# Altium project TP2.PrjPcb
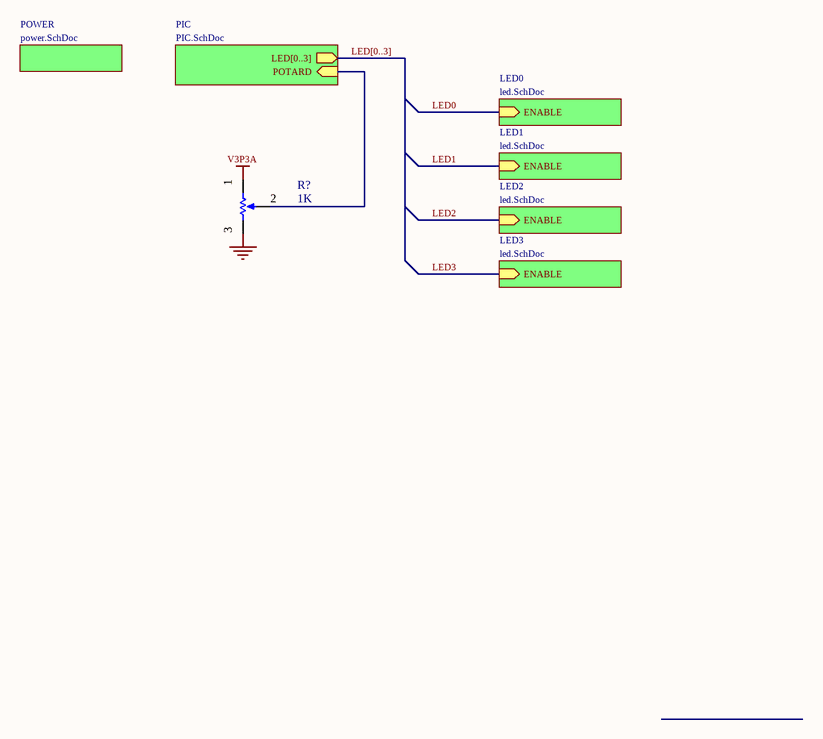
[diagram p0: SChema2.SchDoc]
4 sheets, 36 parts. Net scope: hierarchical (ports join the sheet entries above them; power ports are global).
Sheets:
  SChema2.SchDoc
    POWER = Power.SchDoc
    PIC = PIC.SchDoc
    LED0 = Led.SchDoc
    LED1 = Led.SchDoc
    LED2 = Led.SchDoc
    LED3 = Led.SchDoc

## Sheet SChema2.SchDoc
size A

### Parts
(Parts that share a designator on the sheet are numbered #1, #2 ... from top to bottom, then left to right.)
R?#1  1K  [VR5]

### Sub-sheets
LED0 = led.SchDoc: ENABLE (in)
LED1 = led.SchDoc: ENABLE (in)
LED2 = led.SchDoc: ENABLE (in)
LED3 = led.SchDoc: ENABLE (in)
PIC = PIC.SchDoc: LED[0..3] (out), POTARD (in)
POWER = power.SchDoc: no entries

### Nets
GND: R?#1.1(TOP)
V3P3A: R?#1.2(BOT)
2: R?#1.3(TAP) ; sheet PIC/POTARD

### Buses and harness runs
bus LED[0..3] = sheet PIC/LED[0..3]

### Notes on the sheet
- Labels drawn without touching a wire or pin: 1, 3

### Library data of the parts
R?#1 = RPot: Potentiometer; Sim Note: Enter the Resistance value and the set point into parameter fields.; Set Position: 0.5; Published: 8-Jun-2000; LatestRevisionDate: 17-Jul-2002; LatestRevisionNote: Re-released for DXP Platform.; PackageReference: VR5; Publisher: Altium Limited; PackageDescription: Variable Resistor, Thru-Hole; 3 Leads; Value: 1K

## Sheet Power.SchDoc
size A
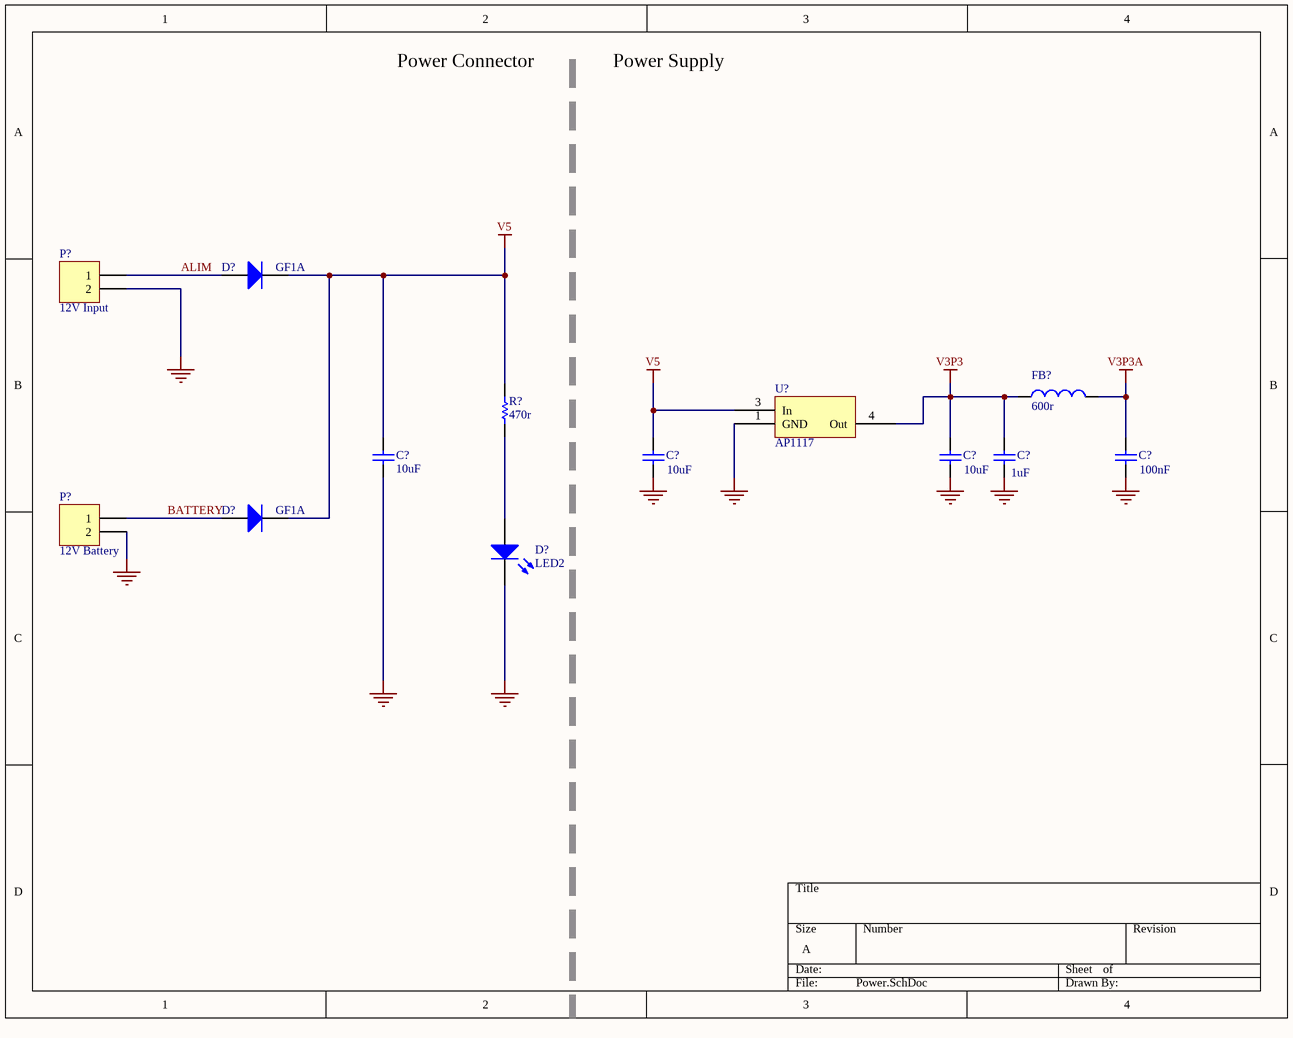
[diagram p1: Power.SchDoc]

### Parts
(Parts that share a designator on the sheet are numbered #1, #2 ... from top to bottom, then left to right.)
C?#1  value 100nF  [RAD-0.3]  (hidden comment: Cap)
C?#2  10uF  [RAD-0.3]
C?#3  value 10uF  [RAD-0.3]  (hidden comment: Cap)
C?#4  value 10uF  [RAD-0.3]  (hidden comment: Cap)
C?#5  value 1uF  [RAD-0.3]  (hidden comment: Cap)
D?#1  GF1A  [SMC]
D?#2  GF1A  [SMC]
D?#3  LED2  [3.2X1.6X1.1]
FB?  600r  [0402-A]
P?#1  12V Input  [HDR1X2]
P?#2  12V Battery  [HDR1X2]
R?#2  470r  [AXIAL-0.3]
U?#1  AP1117

### Nets
GND: C?#1.2 C?#2.1 C?#3.1 C?#4.1 C?#5.1 D?#3.2(K) P?#1.2 P?#2.2 U?#1.1(GND)
V3P3: C?#4.2 C?#5.2 FB?.1 U?#1.4(Out)
V3P3A: C?#1.1 FB?.2
V5: C?#2.2 C?#3.2 D?#1.2(K) D?#2.2(K) R?#2.2 U?#1.3(In)
ALIM: D?#1.1(A) P?#1.1
BATTERY: D?#2.1(A) P?#2.1
NetD?#3_1: D?#3.1(A) R?#2.1

### Notes on the sheet
- Power Connector
- Power Supply

### Library data of the parts
C?#1 C?#3-C?#5 = Cap: Capacitor; Published: 8-Jun-2000; LatestRevisionDate: 17-Jul-2002; LatestRevisionNote: Re-released for DXP Platform.; PackageReference: RAD-0.3; Publisher: Altium Limited; PackageDescription: Radial Cap, Thru-Hole; 2 Leads; 0.3 in Pin Spacing
C?#2 = Cap: Capacitor; Value: 100pF; Published: 8-Jun-2000; LatestRevisionDate: 17-Jul-2002; LatestRevisionNote: Re-released for DXP Platform.; PackageReference: RAD-0.3; Publisher: Altium Limited; PackageDescription: Radial Cap, Thru-Hole; 2 Leads; 0.3 in Pin Spacing
D?#1 = Diode: Default Diode; Published: 8-Jun-2000; LatestRevisionDate: 17-Jul-2002; LatestRevisionNote: Re-released for DXP Platform.; PackageVersion: Sep-1996; PackageReference: SMC; Publisher: Altium Limited; PackageDescription: DO-214-AB/SMC; 2 C-Bend Leads; Body 7.9 x 5.9 mm, inc. leads (LxW); Code_JEDEC: DO-214-AB
D?#2 = Diode: Published: 8-Jun-2000; LatestRevisionDate: 17-Jul-2002; LatestRevisionNote: Re-released for DXP Platform.; PackageVersion: Sep-1996; PackageReference: SMC; Publisher: Altium Limited; PackageDescription: DO-214-AB/SMC; 2 C-Bend Leads; Body 7.9 x 5.9 mm, inc. leads (LxW); Code_JEDEC: DO-214-AB
D?#3 = LED2: Typical RED, GREEN, YELLOW, AMBER GaAs LED; Published: 8-Jun-2000; LatestRevisionDate: 17-Jul-2002; LatestRevisionNote: Re-released for DXP Platform.; PackageVersion: Feb-2002; PackageReference: 3.2X1.6X1.1; Publisher: Altium Limited; PackageDescription: SM LED; 2 Flat Leads
FB? = Inductor: Code_IEC: 1005; Published: 8-Jun-2000; LatestRevisionDate: 29-May-2009; LatestRevisionNote: IPC-7351 Footprint Added.; PackageReference: 0402-A; Publisher: Altium Limited; PackageDescription: Chip Inductor; Code_JEITA: 0402
P?#1 P?#2 = Header 2: Header, 2-Pin; LatestRevisionDate: 17-Jul-2002; LatestRevisionNote: Re-released for DXP Platform.; Publisher: Altium Limited
R?#2 = Res1: Resistor; Value: 1K; Published: 8-Jun-2000; LatestRevisionDate: 17-Jul-2002; LatestRevisionNote: Re-released for DXP Platform.; PackageReference: AXIAL-0.3; Publisher: Altium Limited; PackageDescription: Axial Device, Thru-Hole; 2 Leads; 0.3 in Pin Spacing

## Sheet PIC.SchDoc
size B
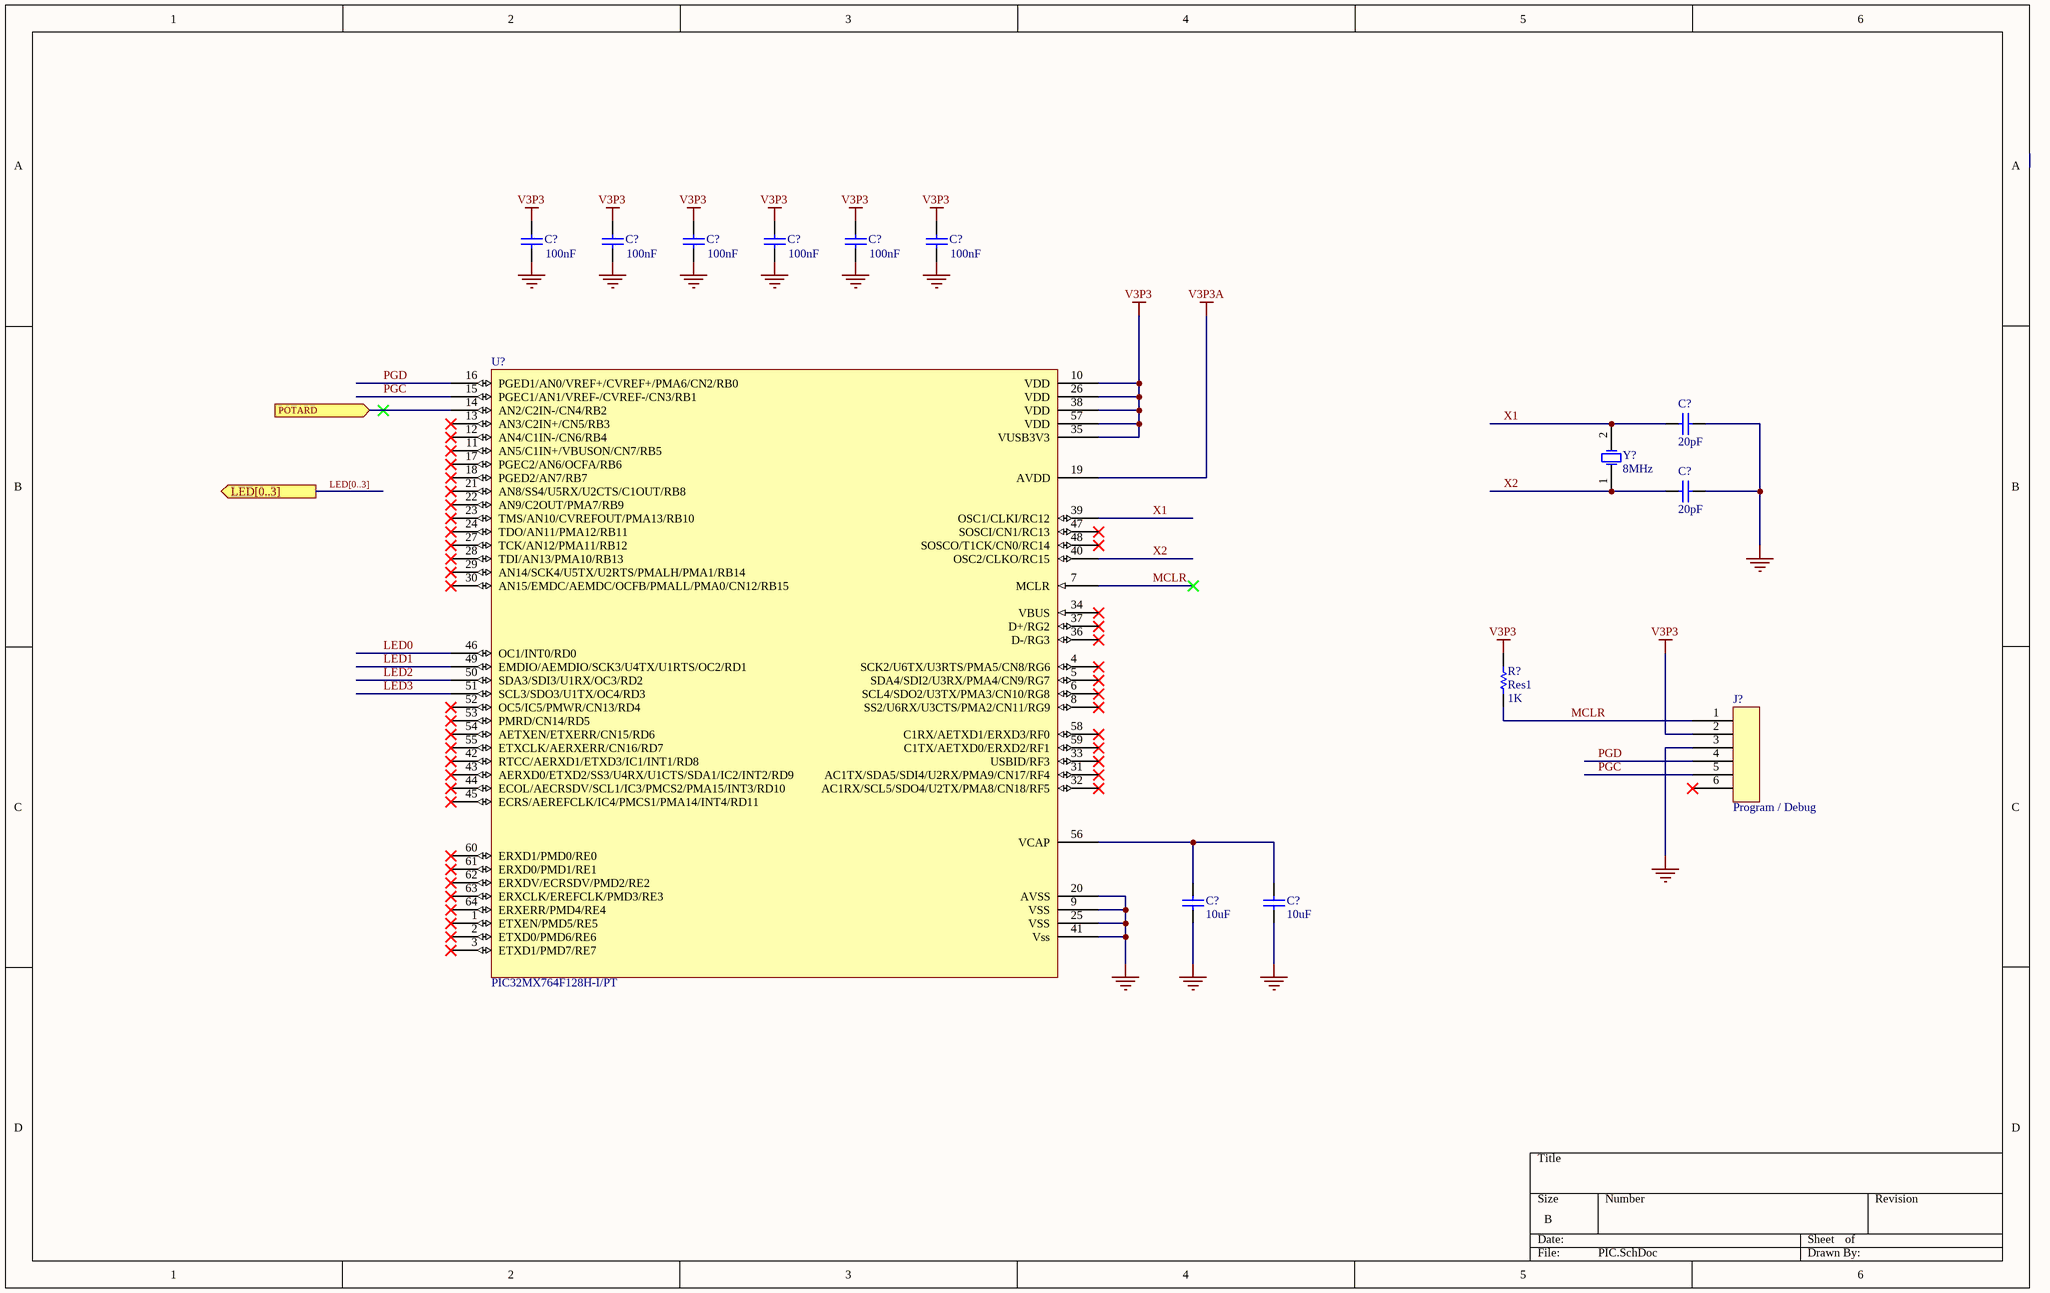
[diagram p2: PIC.SchDoc]

### Parts
(Parts that share a designator on the sheet are numbered #1, #2 ... from top to bottom, then left to right.)
C?#6  100nF  [RAD-0.3]
C?#7  100nF  [RAD-0.3]
C?#8  100nF  [RAD-0.3]
C?#9  100nF  [RAD-0.3]
C?#10  100nF  [RAD-0.3]
C?#11  100nF  [RAD-0.3]
C?#12  20pF  [RAD-0.3]
C?#13  20pF  [RAD-0.3]
C?#14  10uF  [RAD-0.3]
C?#15  10uF  [RAD-0.3]
J?  Program / Debug
R?#3  Res1  value 1K  [AXIAL-0.3]
U?#2  PIC32MX764F128H-I/PT
Y?  8MHz  [R38]

### Ports
LED[0..3] (out), POTARD (in)

### Nets
GND: C?#6.2 C?#7.2 C?#8.2 C?#9.2 C?#10.2 C?#11.2 C?#12.1 C?#13.1 C?#14.1 C?#15.1 J?.3 U?#2.9(VSS) U?#2.20(AVSS) U?#2.25(VSS) U?#2.41(Vss)
V3P3: C?#6.1 C?#7.1 C?#8.1 C?#9.1 C?#10.1 C?#11.1 J?.2 R?#3.2 U?#2.10(VDD) U?#2.26(VDD) U?#2.35(VUSB3V3) U?#2.38(VDD) U?#2.57(VDD)
V3P3A: U?#2.19(AVDD)
2: U?#2.14(AN2/C2IN-/CN4/RB2) ; port POTARD
LED0: U?#2.46(OC1/INT0/RD0)
LED1: U?#2.49(EMDIO/AEMDIO/SCK3/U4TX/U1RTS/OC2/RD1)
LED2: U?#2.50(SDA3/SDI3/U1RX/OC3/RD2)
LED3: U?#2.51(SCL3/SDO3/U1TX/OC4/RD3)
MCLR: J?.1 R?#3.1 U?#2.7(MCLR)
PGC: J?.5 U?#2.15(PGEC1/AN1/VREF-/CVREF-/CN3/RB1)
PGD: J?.4 U?#2.16(PGED1/AN0/VREF+/CVREF+/PMA6/CN2/RB0)
X1: C?#12.2 U?#2.39(OSC1/CLKI/RC12) Y?.2(OSC2)
X2: C?#13.2 U?#2.40(OSC2/CLKO/RC15) Y?.1(OSC1)
NetC?#14_2: C?#14.2 C?#15.2 U?#2.56(VCAP)

Not connected (* = marked no-connect by the designer): J? 6(1)*; U?#2 1(ETXEN/PMD5/RE5)* 2(ETXD0/PMD6/RE6)* 3(ETXD1/PMD7/RE7)* 4(SCK2/U6TX/U3RTS/PMA5/CN8/RG6)* 5(SDA4/SDI2/U3RX/PMA4/CN9/RG7)* 6(SCL4/SDO2/U3TX/PMA3/CN10/RG8)* 8(SS2/U6RX/U3CTS/PMA2/CN11/RG9)* 11(AN5/C1IN+/VBUSON/CN7/RB5)* 12(AN4/C1IN-/CN6/RB4)* 13(AN3/C2IN+/CN5/RB3)* 17(PGEC2/AN6/OCFA/RB6)* 18(PGED2/AN7/RB7)* 21(AN8/SS4/U5RX/U2CTS/C1OUT/RB8)* 22(AN9/C2OUT/PMA7/RB9)* 23(TMS/AN10/CVREFOUT/PMA13/RB10)* 24(TDO/AN11/PMA12/RB11)* 27(TCK/AN12/PMA11/RB12)* 28(TDI/AN13/PMA10/RB13)* 29(AN14/SCK4/U5TX/U2RTS/PMALH/PMA1/RB14)* 30(AN15/EMDC/AEMDC/OCFB/PMALL/PMA0/CN12/RB15)* 31(AC1TX/SDA5/SDI4/U2RX/PMA9/CN17/RF4)* 32(AC1RX/SCL5/SDO4/U2TX/PMA8/CN18/RF5)* 33(USBID/RF3)* 34(VBUS)* 36(D-/RG3)* 37(D+/RG2)* 42(RTCC/AERXD1/ETXD3/IC1/INT1/RD8)* 43(AERXD0/ETXD2/SS3/U4RX/U1CTS/SDA1/IC2/INT2/RD9)* 44(ECOL/AECRSDV/SCL1/IC3/PMCS2/PMA15/INT3/RD10)* 45(ECRS/AEREFCLK/IC4/PMCS1/PMA14/INT4/RD11)* 47(SOSCI/CN1/RC13)* 48(SOSCO/T1CK/CN0/RC14)* 52(OC5/IC5/PMWR/CN13/RD4)* 53(PMRD/CN14/RD5)* 54(AETXEN/ETXERR/CN15/RD6)* 55(ETXCLK/AERXERR/CN16/RD7)* 58(C1RX/AETXD1/ERXD3/RF0)* 59(C1TX/AETXD0/ERXD2/RF1)* 60(ERXD1/PMD0/RE0)* 61(ERXD0/PMD1/RE1)* 62(ERXDV/ECRSDV/PMD2/RE2)* 63(ERXCLK/EREFCLK/PMD3/RE3)* 64(ERXERR/PMD4/RE4)*

### Buses and harness runs
bus LED[0..3] = port LED[0..3]

### Library data of the parts
C?#6-C?#15 = Cap: Capacitor; Published: 8-Jun-2000; LatestRevisionDate: 17-Jul-2002; LatestRevisionNote: Re-released for DXP Platform.; PackageReference: RAD-0.3; Publisher: Altium Limited; PackageDescription: Radial Cap, Thru-Hole; 2 Leads; 0.3 in Pin Spacing
J? = Program debug
R?#3 = Res1: Resistor; Published: 8-Jun-2000; LatestRevisionDate: 17-Jul-2002; LatestRevisionNote: Re-released for DXP Platform.; PackageReference: AXIAL-0.3; Publisher: Altium Limited; PackageDescription: Axial Device, Thru-Hole; 2 Leads; 0.3 in Pin Spacing
Y? = XTAL: Crystal Oscillator; Published: 8-Jun-2000; LatestRevisionDate: 17-Jul-2002; LatestRevisionNote: Re-released for DXP Platform.; PackageReference: R38; Publisher: Altium Limited; PackageDescription: Crystal, Thru-Hole; 2 Leads; Body 3.1 x 8.2 mm (Dia.xH)

## Sheet Led.SchDoc
size A
Used 4 times, as channels LED0, LED1, LED2, LED3. Parts and nets are listed once, with the designators drawn on the sheet.
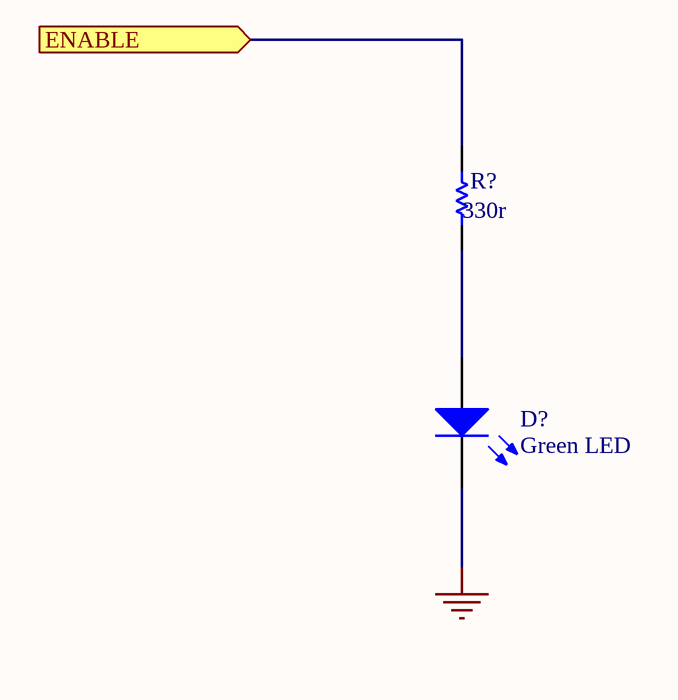
[diagram p3: Led.SchDoc]

### Parts
D?  Green LED  [LED-0]
R?  value 330r  [AXIAL-0.3]  (hidden comment: Res1)

### Ports
ENABLE (in)

### Nets
GND: D?.2(K)
ENABLE: R?.2 ; port ENABLE
NetD?_1: D?.1(A) R?.1

### Channels
LED0: designators end in _LED0; ports ENABLE=LED0
LED1: designators end in _LED1; ports ENABLE=LED1
LED2: designators end in _LED2; ports ENABLE=LED2
LED3: designators end in _LED3; ports ENABLE=LED3

### Library data of the parts
D? = LED0: Typical INFRARED GaAs LED; Published: 8-Jun-2000; LatestRevisionDate: 08-Jul-2005; LatestRevisionNote: Mech Layer 1 removed.; PackageReference: LED-0; Publisher: Altium Limited; PackageDescription: LED; 2 Leads
R? = Res1: Resistor; Published: 8-Jun-2000; LatestRevisionDate: 17-Jul-2002; LatestRevisionNote: Re-released for DXP Platform.; PackageReference: AXIAL-0.3; Publisher: Altium Limited; PackageDescription: Axial Device, Thru-Hole; 2 Leads; 0.3 in Pin Spacing

## Nets that join several sheets
GND: SChema2 (R?#1.1), Power (9 pins), PIC (15 pins), LED0 (D?_LED0.2), LED1 (D?_LED1.2), LED2 (D?_LED2.2), LED3 (D?_LED3.2)
V3P3: Power (C?#4.2 C?#5.2 FB?.1 U?#1.4), PIC (13 pins)
V3P3A: SChema2 (R?#1.2), Power (C?#1.1 FB?.2), PIC (U?#2.19)
2: SChema2 (R?#1.3), PIC (U?#2.14)
LED0: PIC (U?#2.46), LED0 (R?_LED0.2)
LED1: PIC (U?#2.49), LED1 (R?_LED1.2)
LED2: PIC (U?#2.50), LED2 (R?_LED2.2)
LED3: PIC (U?#2.51), LED3 (R?_LED3.2)